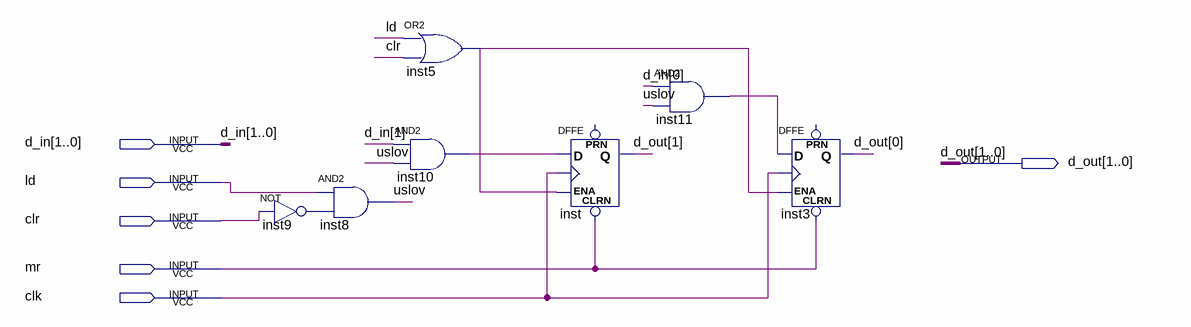
[diagram p0: schematic sheet]
// Quartus schematic reg_2b_clr.bdf as structural Verilog: 7 symbols, 6 pins
module reg_2b_clr (
  input  [1:0] d_in,
  input  ld,
  input  clr,
  input  mr,
  input  clk,
  output [1:0] d_out
);

  wire inst5_out, inst9_out, inst10_out, inst11_out, uslov;

  not inst9 (inst9_out, clr);
  and inst8 (uslov, ld, inst9_out);
  or inst5 (inst5_out, ld, clr);
  and inst10 (inst10_out, d_in[1], uslov);
  DFFE inst (.CLRN(mr), .D(inst10_out), .CLK(clk), .ENA(inst5_out), .Q(d_out[1]));  // open: PRN
  and inst11 (inst11_out, d_in[0], uslov);
  DFFE inst3 (.CLRN(mr), .D(inst11_out), .CLK(clk), .ENA(inst5_out), .Q(d_out[0]));  // open: PRN
endmodule
